# Altium schematic sheet E1.SchDoc
size 420 x 297 mm; Address1: Address1; Address2: Address2; Address3: Address3; Address4: Address4; DocumentNumber: АБВГ.123456.001 Э1; SheetNumber: 1; SheetTotal: 5; DocumentType: Схема электрическая принципиальная; FirstReferrence: АБВГ.123456.001; Разработал: Лисица А.Е.; Проверил: Курносенко А.Е.; Тип чертежа: Схема электрическая структурная; Название: Устройство управления; Учреждение: МГТУ им. Н. Э. Баумана; Группа: ИУ4-81Б; Децимальный номер: ИУ4.11.03.03.26.08.81.12.001 Э1; Лист: 1; Кафедра: Кафедра ИУ4; Децимальный номер СП: ИУ4.11.03.03.26.08.81.12.001 Э1; Продолжение названия: шаговым двигателем; Листов: 1
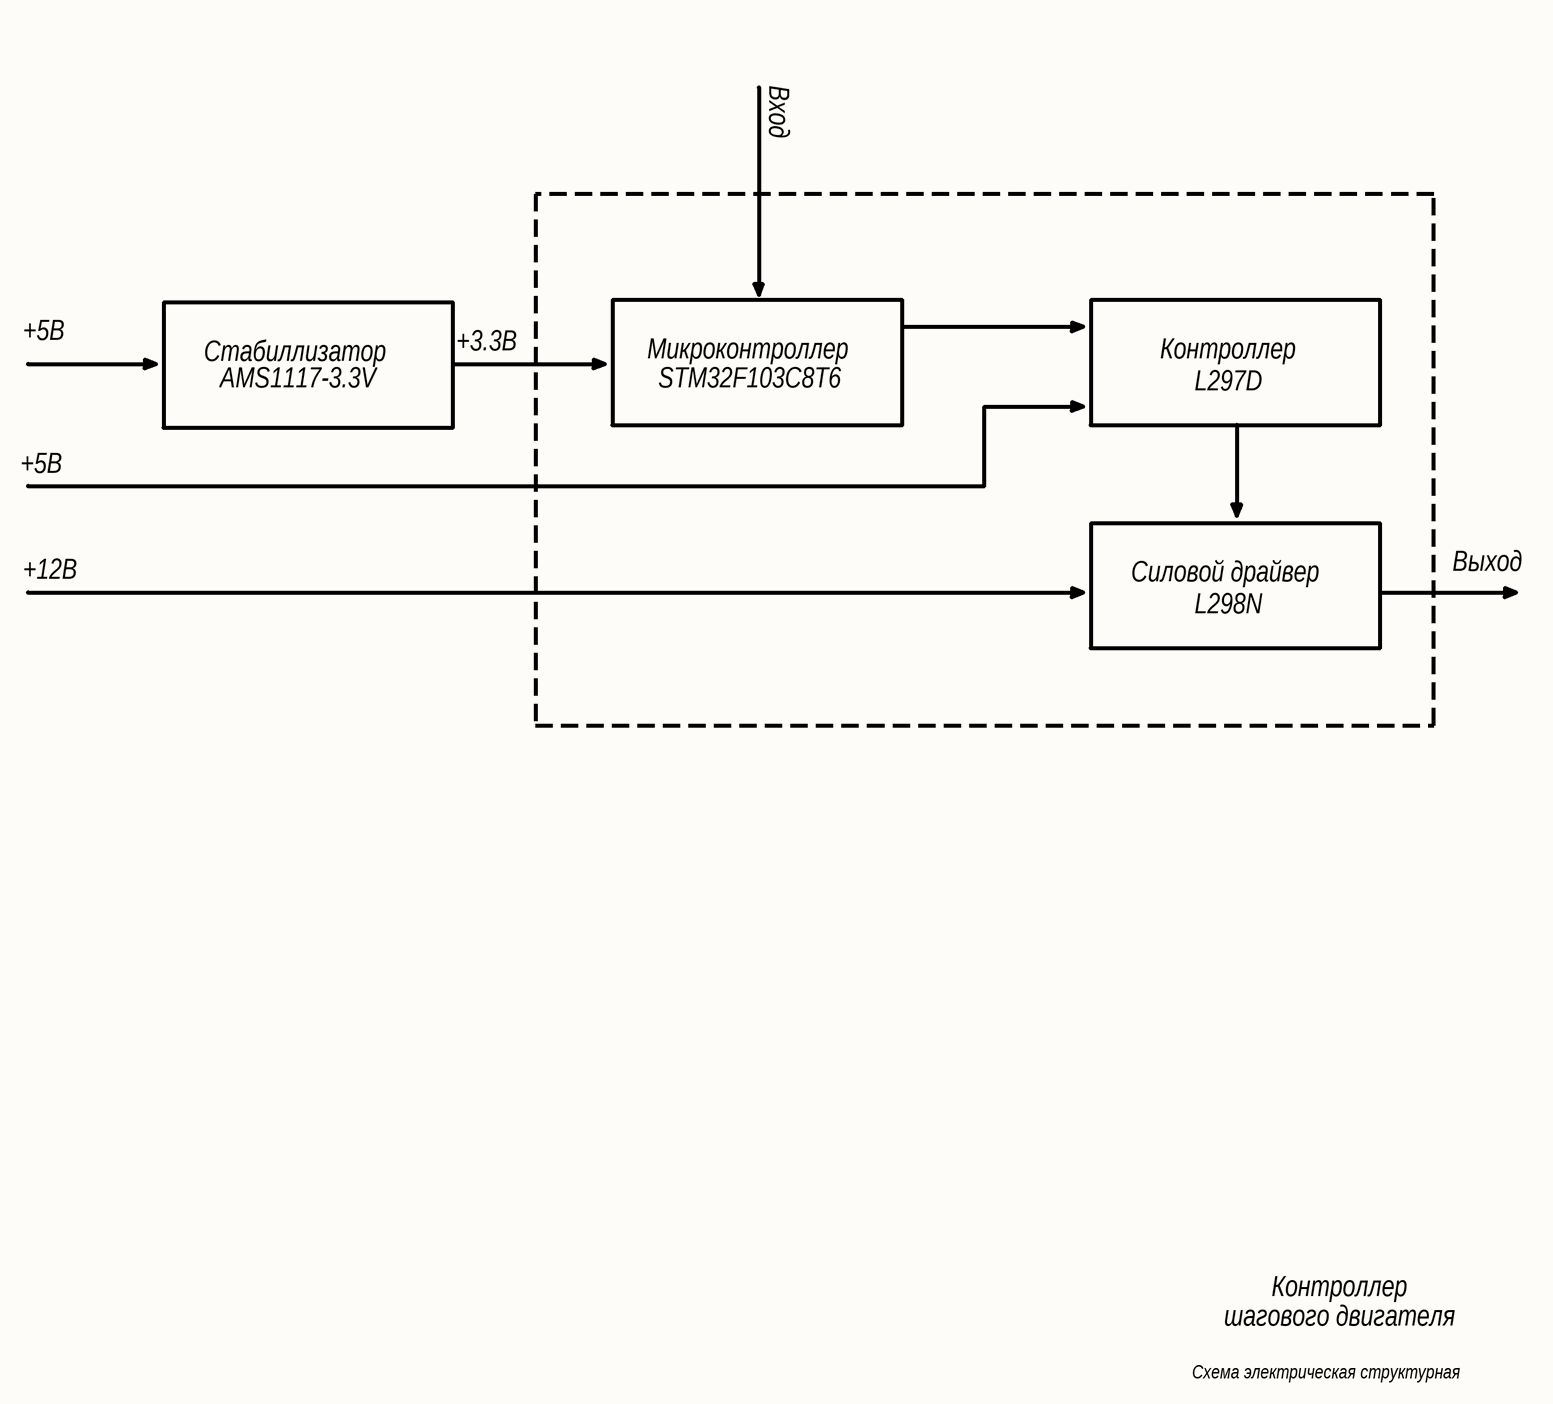
[diagram p0: E1.SchDoc]

## Notes on the sheet
- Вход
- +5В
- Стабиллизатор
- +3.3В
- Микроконтроллер
- Контроллер
- AMS1117-3.3V
- STM32F103C8T6
- L297D
- Выход
- +12В
- Силовой драйвер
- L298N
- Схема электрическая структурная
- шагового двигателя
- Перв. примен.
- Справ. №
- Подп. и дата
- Инв. № дубл.
- Взам. инв. №
- Разраб.
- Изм.
- Лист
- № докум.
- Подп.
- Дата
- Литера
- Масса
- Масштаб
- Пров.
- Т.контр.
- Листов
- Инв. № подл.
- Утв.
- Н.контр.
- 2.106-A3
- Копировал
- Формат А3